# Altium project Sample_Holder_DC_Small.PrjPcb
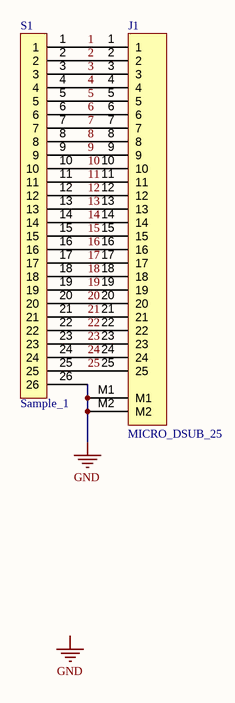
[diagram p0: Sample_Holder_DC_Small.SchDoc]
1 sheet, 2 parts. Net scope: global (net labels, ports and power ports of the same name join across sheets).
Board file: Sample_Holder_DC_Small.PcbDoc

## Sheet Sample_Holder_DC_Small.SchDoc
size 594 x 420 mm

### Parts
J1  MICRO_DSUB_25  [581-M25-113L461]
S1  Sample_1  [Sample_1]

### Nets
GND: J1.M1 J1.M2 S1.26
1: J1.1 S1.1
2: J1.2 S1.2
3: J1.3 S1.3
4: J1.4 S1.4
5: J1.5 S1.5
6: J1.6 S1.6
7: J1.7 S1.7
8: J1.8 S1.8
9: J1.9 S1.9
10: J1.10 S1.10
11: J1.11 S1.11
12: J1.12 S1.12
13: J1.13 S1.13
14: J1.14 S1.14
15: J1.15 S1.15
16: J1.16 S1.16
17: J1.17 S1.17
18: J1.18 S1.18
19: J1.19 S1.19
20: J1.20 S1.20
21: J1.21 S1.21
22: J1.22 S1.22
23: J1.23 S1.23
24: J1.24 S1.24
25: J1.25 S1.25

### Notes on the sheet
- Labels drawn without touching a wire or pin: GND
- 10
- 9
- 8
- 7
- 6
- 5
- 4
- 3
- DWG. NO.
- 2
- 1
- THIS DOCUMENT AND THE DATA DISCLOSED HEREIN OR HEREWITH IS THE PROPERTY OF ALTIUM LIMITED AND MAY BE FREELY DISTRIBUTED IN WHOLE. NO RIGHTS ARE RESERVED OR EXPRESS OR IMPLIED WARANTEE GIVEN.
- REV.
- SHT.
- REVISION
- DESCRIPTION
- DATE
- APPROVED
- H
- G
- F
- E
- D
- C
- B
- ENG:
- DSN:
- APPROVALS
- PROJECT
- DOCUMENT REVISION:
- DESIGN ITEM:
- A
- CHK:
- BOM:
- REFERENCE DOCUMENTS
- PROJECT REVISION:
- TITLE
- FAB DWG:
- PCB DWG:
- ASSY DWG:
- SCALE:
- A2
- SIZE
- CAGE CODE
- FILE NAME
- DWG NO.
- SHEET
- OF
- REV

### Library data of the parts
J1 = MICRO_DSUB_25: Micro D-Sub 25 pin connector